# EAGLE design Ham-Dip-V2-002 (EAGLE 8.2.1)
VCC: 5v
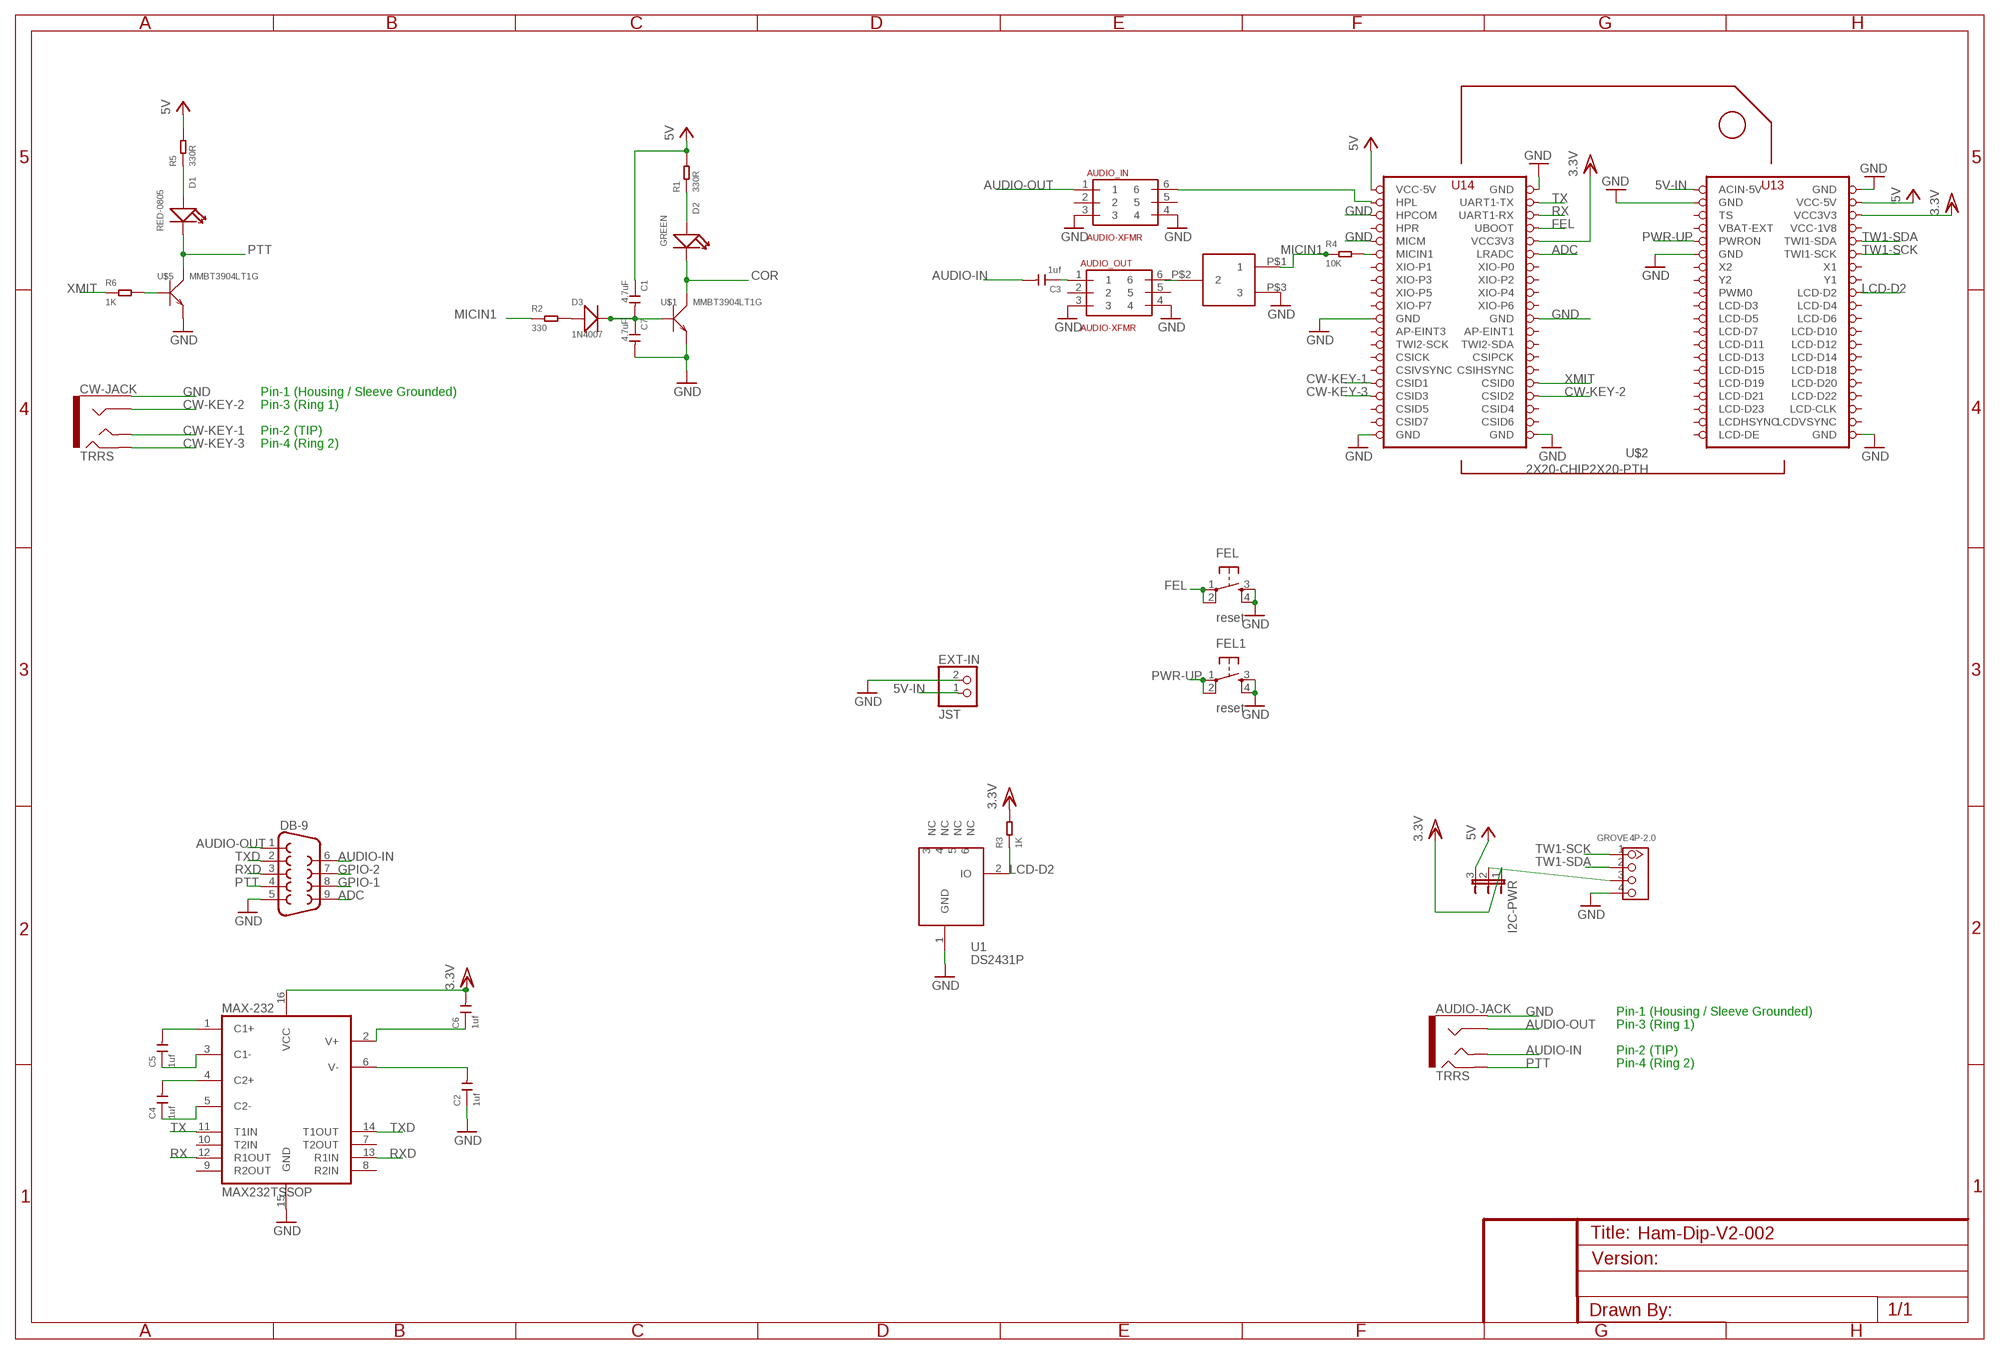
[diagram p0: schematic, sheet 1]

## Parts
AUDIO-JACK  TRRS  AUDIO-JACK3  [AUDIO-JACK-TRRS-SMD]
AUDIO_IN  AUDIO-XFMR  SM-LP-5001  [SM-LP-5001]
AUDIO_OUT  AUDIO-XFMR  SM-LP-5001  [SM-LP-5001]
C1  4.7uF  CERAMIC-1UF-25V-10%-X7R(0805)  [C0805]
C2  1uf  CERAMIC-1UF-25V-10%-X7R(0805)  [C0805]
C3  1uf  CERAMIC-1UF-25V-10%-X7R(0805)  [C0805]
C4  1uf  CERAMIC-1UF-25V-10%-X7R(0805)  [C0805]
C5  1uf  CERAMIC-1UF-25V-10%-X7R(0805)  [C0805]
C6  1uf  CERAMIC-1UF-25V-10%-X7R(0805)  [C0805]
C7  4.7uF  CERAMIC-1UF-25V-10%-X7R(0805)  [C0805]
CW-JACK  TRRS  AUDIO-JACK3  [AUDIO-JACK-TRRS-SMD]
D1  RED-0805  SMD-LED-CLEAR-RED(0805)  [LED-0805]
D2  GREEN  SMD-LED-CLEAR-RED(0805)  [LED-0805]
D3  1N4007  DIODE-GEN-PURPOSE-1KV-1A(DO-214AC)  [DO-214AC]
DB-9  DB9FEMALE  [DB9]
EXT-IN  JST  JST_2PIN-THM  [JST-PH-2-THM]
FEL  reset  TAC_SWITCHSMD  [TACTILE_SWITCH_SMD]
FEL1  reset  TAC_SWITCHSMD  [TACTILE_SWITCH_SMD]
GROVE  4P-2.0  GROVE-CONNECTOR-DIP(4P-2.0)  [HW4-2.0]
I2C-PWR  JP2E  [JP2]
MAX-232  MAX232TSSOP  [TSSOP16]
R1  330R  SMD-RES-220R-5%-1/8W(0805)  [R0805]
R2  330  SMD-RES-220R-5%-1/8W(0805)  [R0805]
R3  1K  SMD-RES-220R-5%-1/8W(0805)  [R0805]
R4  10K  SMD-RES-10K-1%-1/8W(0805)  [R0805]
R5  330R  SMD-RES-220R-5%-1/8W(0805)  [R0805]
R6  1K  SMD-RES-220R-5%-1/8W(0805)  [R0805]
U1  DS2431P  [TSOC6]
U$1  MMBT3904LT1G  SMD-TRANSISTORS-NPN-40V-200MA-MMBT3904LT1G(SOT-23)  [SOT-23]
U$2  2X20-CHIP2X20-PTH  2X20-CHIP2X20-PTH-CHIP_A  [2X20CHIP-TH]
U$3  TC33X  [TC33X]
U$5  MMBT3904LT1G  SMD-TRANSISTORS-NPN-40V-200MA-MMBT3904LT1G(SOT-23)  [SOT-23]

## Nets
5V-IN: EXT-IN.1 U$2.CHG-IN(ACIN-5V)
ADC: DB-9.9 U$2.LRADC
AUDIO-IN: AUDIO-JACK.TIP C3.2 DB-9.6
AUDIO-OUT: AUDIO-JACK.RING1 AUDIO_IN.1 DB-9.1
COR: D2.- U$1.3(C)
CW-KEY-1: CW-JACK.TIP U$2.CSID1
CW-KEY-2: CW-JACK.RING1 U$2.CSID2
CW-KEY-3: CW-JACK.RING2 U$2.CSID3
FEL: FEL.1 FEL.2 U$2.FEL(UBOOT)
GND: AUDIO-JACK.EARTH AUDIO_IN.3 AUDIO_IN.4 AUDIO_OUT.3 AUDIO_OUT.4 C2.1 C7.2 CW-JACK.EARTH DB-9.5 EXT-IN.2 FEL1.3 FEL1.4 FEL.3 FEL.4 GROVE.4 MAX-232.15(GND) U1.1(GND) U$1.2(E) U$2.GND@1(GND) U$2.GND@2(GND) U$2.GND@3(GND) U$2.GND@4(GND) U$2.GND@5(GND) U$2.GND@6(GND) U$2.GND@7(GND) U$2.GND@8(GND) U$2.GND@10(GND) U$2.HPCOM U$2.MICM U$3.P$3 U$5.2(E)
GPIO-1: DB-9.8
GPIO-2: DB-9.7
IN: AUDIO_OUT.1 C3.1
LCD-D2: R3.1 U1.2(IO) U$2.LCD-D2
MICIN1: R2.1 R4.2 U$2.MICIN1
N$1: D1.+ R5.1
N$3: AUDIO_IN.6 U$2.HPL
N$4: U$3.P$2
N$5: GROVE.3 I2C-PWR.2
N$6: C6.1 MAX-232.2(V+)
N$7: R4.1 U$3.P$1
N$8: R6.2 U$5.1(B)
N$9: D2.+ R1.1
N$10: C1.2 C7.1 D3.2(-) U$1.1(B)
N$11: C2.2 MAX-232.6(V-)
N$12: D3.1(+) R2.2
N$16: C5.2 MAX-232.1(C1+)
N$17: C4.2 MAX-232.4(C2+)
N$18: C5.1 MAX-232.3(C1-)
N$19: C4.1 MAX-232.5(C2-)
PTT: AUDIO-JACK.RING2 D1.- DB-9.4 U$5.3(C)
PWR-UP: FEL1.1 FEL1.2 U$2.PWRON
RX: MAX-232.12(R1OUT) U$2.UART1-RX
RXD: DB-9.3 MAX-232.13(R1IN)
TW1-SCK: GROVE.1 U$2.TWI1-SCK
TW1-SDA: GROVE.2 U$2.TWI1-SDA
TX: MAX-232.11(T1IN) U$2.UART1-TX
TXD: DB-9.2 MAX-232.14(T1OUT)
VCC: C1.1 I2C-PWR.3 R1.2 R5.2 U$2.VCC5V@0(VCC-5V) U$2.VCC5V@1(VCC-5V) ; supply symbol labelled 5V
VCC/2: C6.2 I2C-PWR.1 MAX-232.16(VCC) R3.2 U$2.VCC3V3 U$2.VCC3V3@1(VCC3V3) ; supply symbol labelled 3.3V
XMIT: R6.1 U$2.CSID0
Unconnected: AUDIO_IN.2 AUDIO_IN.5 AUDIO_OUT.2 AUDIO_OUT.5 AUDIO_OUT.6 MAX-232.7(T2OUT) MAX-232.8(R2IN) MAX-232.9(R2OUT) MAX-232.10(T2IN) U1.3(NC) U1.4(NC) U1.5(NC) U1.6(NC) U$2.AP-EINT1 U$2.AP-EINT3 U$2.BAT(VBAT-EXT) U$2.CSICK U$2.CSID4 U$2.CSID5 U$2.CSID6 U$2.CSID7 U$2.CSIHSYNC U$2.CSIPCK U$2.CSIVSYNC U$2.HPR U$2.LCD-CLK U$2.LCD-D3 U$2.LCD-D4 U$2.LCD-D5 U$2.LCD-D6 U$2.LCD-D7 U$2.LCD-D10 U$2.LCD-D11 U$2.LCD-D12 U$2.LCD-D13 U$2.LCD-D14 U$2.LCD-D15 U$2.LCD-D18 U$2.LCD-D19 U$2.LCD-D20 U$2.LCD-D21 U$2.LCD-D22 U$2.LCD-D23 U$2.LCD-DE U$2.LCD-HSYNC(LCDHSYNC) U$2.LCD-VSYNC(LCDVSYNC) U$2.PWM0 U$2.TS U$2.TWI2-SCK U$2.TWI2-SDA U$2.X1 U$2.X2 U$2.XIO-P0 U$2.XIO-P1 U$2.XIO-P2 U$2.XIO-P3 U$2.XIO-P4 U$2.XIO-P5 U$2.XIO-P6 U$2.XIO-P7 U$2.Y1 U$2.Y2

## Notes on the sheet
- Pin-1 (Housing / Sleeve Grounded)
- Pin-3 (Ring 1)
- Pin-2 (TIP)
- Pin-4 (Ring 2)
- Pin-1 (Housing / Sleeve Grounded)
- Pin-3 (Ring 1)
- Pin-2 (TIP)
- Pin-4 (Ring 2)

## Power pins joined to a net without a drawn wire
VCC-1V8: U$2.VCC1V8(VCC-1V8)

## Library data of the parts
AUDIO-JACK CW-JACK = SparkFun-Connectors:AUDIO-JACK3: Audio jack - 3.5mm TRRS variety - two rings.
AUDIO_IN AUDIO_OUT = HalfBakedCircuits:SM-LP-5001
C1 C7 = Seeed-Capacitor-2016:CERAMIC-1UF-25V-10%-X7R(0805): 302010179; MPN: CC0805KKX7R8BB105; VALUE: 1uf
C2-C6 = Seeed-Capacitor-2016:CERAMIC-1UF-25V-10%-X7R(0805): 302010179; MPN: CC0805KKX7R8BB105
D1 = Seeed-LED-2016:SMD-LED-CLEAR-RED(0805): 304090046; MPN: 17-215SURC/S530-A2/TR8
D2 = Seeed-LED-2016:SMD-LED-CLEAR-RED(0805): 304090046; MPN: 17-215SURC/S530-A2/TR8; VALUE: RED-0805
D3 = Seeed-Diode:DIODE-GEN-PURPOSE-1KV-1A(DO-214AC): 304010013; MPN: 1N4007
DB-9 = SparkFun-Connectors:DB9: DB9 Connector Standard DB9 (D-Sub 9) serial connector. Can be used for CAN bus as well as RS485 and RS232. Footprint production proven. Here is the female version connector we sell at SparkFun: 9 Pin Female Serial Connector - PCB Mount <https://www.sparkfun.com/products/429> (PRT-00429) This connector has been used on the following SparkFun products: SparkFun RS232 Shifter - SMD <https://www.sparkfun.com/products/449> (PRT-00449) SparkFun RS232 Shifter SMD (No DB9) <https://www.sparkfun.com/products/8780> (PRT-08780); PROD_ID: CONN-08194
EXT-IN = adafruit:JST_2PIN: JST 2-Pin Connectors of various flavors SMT-RA (S2B-PH-SM4) 4UConnector #17311 SMT (B2B-PH-SM4) THM-RA (S2B-PH) THM (B2B-PH)
FEL FEL1 = SparkFun-Electromechanical:TAC_SWITCH: Momentary Switch Button commonly used for reset or general input. Spark Fun Electronics SKU : COM-00097 SMT- SWCH-08247; PROD_ID: SWCH-08247
GROVE = Seeed-Connector -2016:GROVE-CONNECTOR-DIP(4P-2.0): 320110033
I2C-PWR = jumper:JP2E: JUMPER
MAX-232 = SparkFun-DigitalIC:MAX232: RS232 Transceiver Very common IC. This is generically called 'MAX232', but works with the 3V equivalent MAX3232 generic ICs. Field tested and mother approved. Spark Fun Electronics SKU : COM-00316 (DIP) and COM-00589 (SMD)
R1-R3 R5 R6 = Seeed-Resistor-2016:SMD-RES-220R-5%-1/8W(0805): 301010315; MPN: RC0805JR-07220RL; VALUE: 220R
R4 = Seeed-Resistor-2016:SMD-RES-10K-1%-1/8W(0805): 301010361; MPN: RC0805FR-0710KL
U1 = JKW_CHIP:DS2431: 1024-Bit EEPROM This chip provides a 4x256 Bit EEPROM, which can be programmed@5V. Write protection and OTP emulation are available, too. Author: Jan Kandziora <jjj@gmx.de>; DESCRIPTION: IC, 1024-Bit, 1-Wire EEPROM, TSOC6; FOOTPRINT: TSOC6; LINK: http://www.digikey.com/product-detail/en/DS2431P%2BT%26R/DS2431P%2BT%26RCT-ND/3647900; MFG: DIGIKEY; MFG_PN: DS2431P+T&RCT-ND; PART_TYPE: IC; PRICE: 0.98; VENDOR: MAXIM; VENDOR_PART_NUMBER: DS2431P+T&R
U$1 U$5 = Seeed-Transistor-2016:SMD-TRANSISTORS-NPN-40V-200MA-MMBT3904LT1G(SOT-23): 305010013; MPN: MMBT3904LT1G
U$2 = JKW_CHIP:2X20-CHIP: Chip header; DESCRIPTION: 2x20 .100" headers; FOOTPRINT: 2x20 .100" CHIP foot print; VENDOR: ASSMANN; VENDOR_PART_NUMBER: AWHW40-G-SMD-R (single)
U$3 = HalfBakedCircuits:TC33X

## Board
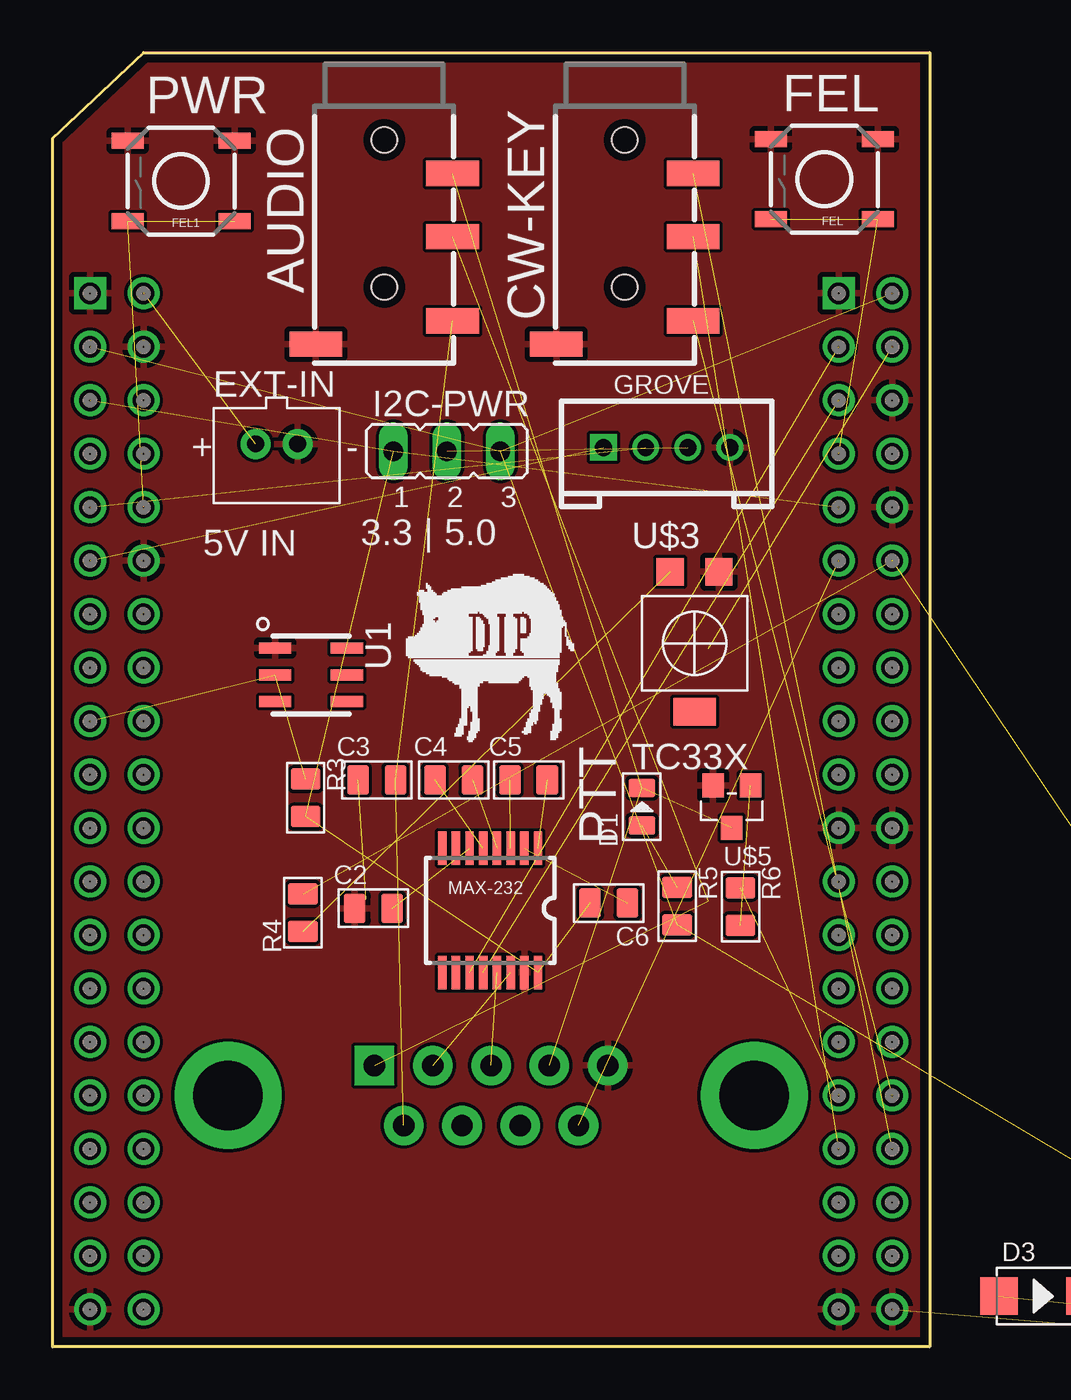
[diagram p1: board, top side]
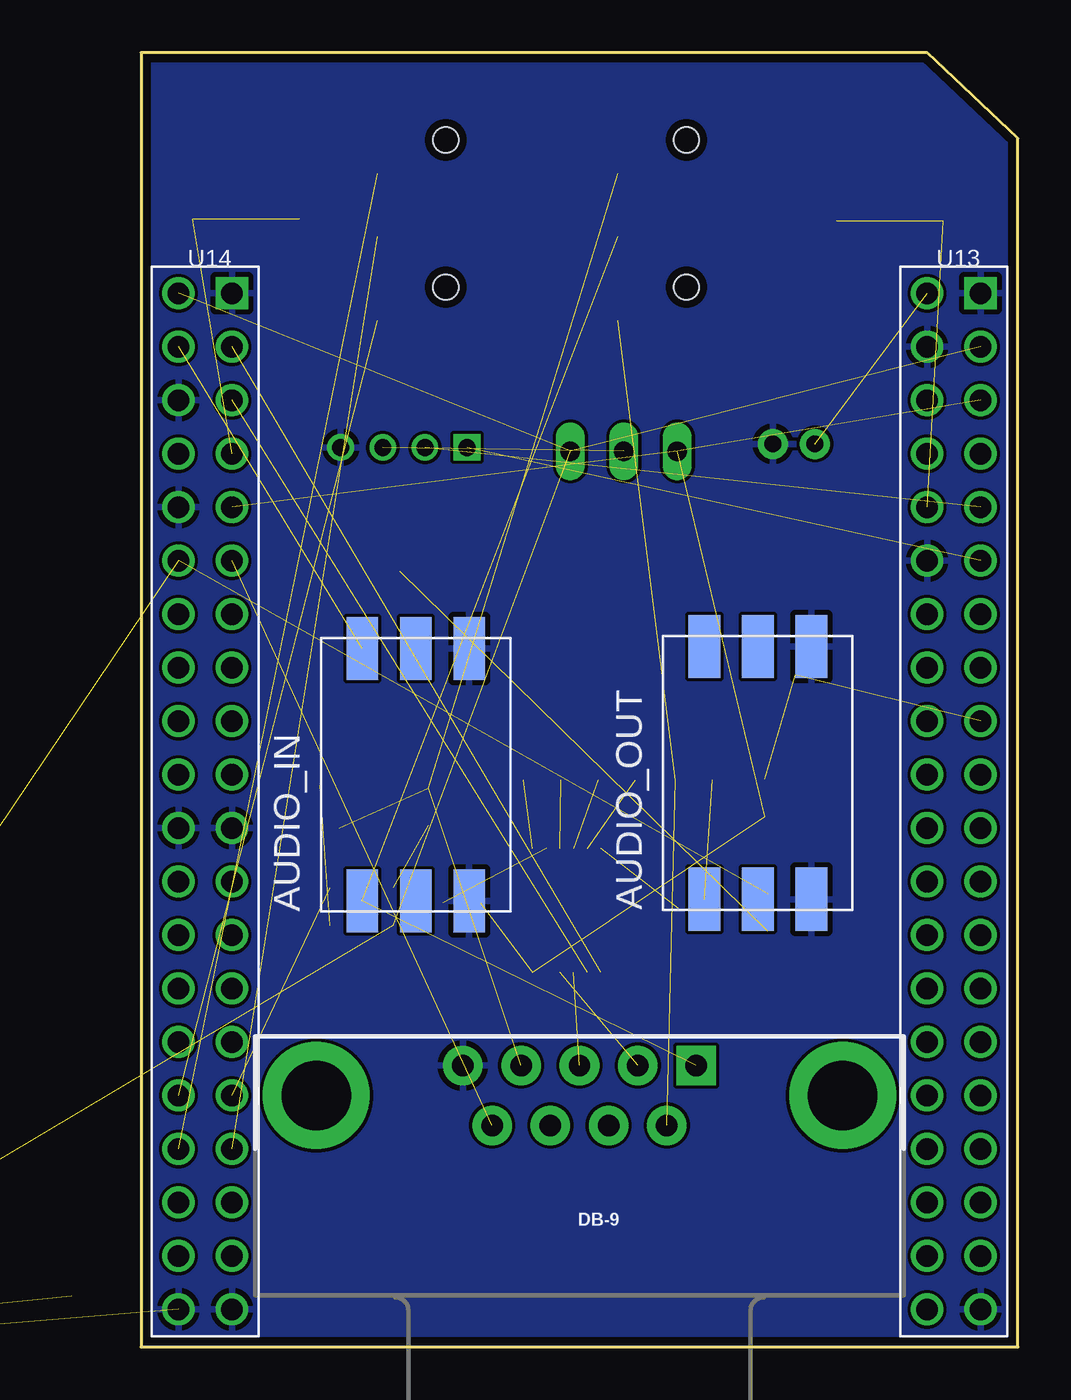
[diagram p2: board, bottom side, seen from below]

Size 41.66 x 61.47 mm. Coordinates in mm from the lower left corner, seen from the top.
Outline: 0,0 0,57.4 4.32,61.47 41.66,61.47 41.66,0 0,0
Copper layers (1*16): Top 0.0356mm / dielectric 1.5011mm / Bottom 0.0356mm
Design rules "oshpark-2layer": minimum track width 6mil, minimum drill 13mil, track to track 6mil, track to pad 6mil, pad to pad 6mil, via to via 6mil, smd to smd 6mil, copper to edge 15mil, drill to drill 6mil, minimum pad ring 7mil, minimum via ring 7mil, stop-mask expansion 2.5mil, vias tented up to drill 0mil, thermal gap 10mil

### Footprints (pad centres in the part's own frame; a part is rotated, then mirrored left to right if it is on the bottom)
AUDIO-JACK-TRRS-SMD = smd 1.2 x 2.5: EARTH 11.3,-3.25; RING1 6.2,3.25; RING2 3.2,3.25; TIP 10.2,3.25 | hole 1.2: 1.6,0; 8.6,0
SM-LP-5001 = smd 3 x 1.5: 1 -6,2.54; 2 -6,0; 3 -6,-2.54; 4 6,-2.54; 5 6,0; 6 6,2.54
C0805 = smd 1.397 x 1.016: 1 0,0.889; 2 0,-0.889
LED-0805 = smd 0.889 x 1.27: + -0.889,0; - 0.889,0
DO-214AC = smd 1.8 x 1.77: 1 -2.042,0; 2 2.042,0
DB9 = drill 1.016 pad 1.88 square: 1 -5.54,-1.42 | drill 1.016 pad 1.88: 2 -2.77,-1.42; 3 0,-1.42; 4 2.77,-1.42; 5 5.54,-1.42; 6 -4.15,1.42; 7 -1.38,1.42; 8 1.38,1.42; 9 4.15,1.42 | drill 3.302 pad 5.08: G1 -12.5,0; G2 12.5,0
JST-PH-2-THM = drill 0.8 pad 1.422: 1 1,0; 2 -1,0
TACTILE_SWITCH_SMD = smd 1.524 x 0.762: 1 -2.54,1.905; 2 2.54,1.905; 3 -2.54,-1.905; 4 2.54,-1.905
HW4-2.0 = drill 0.8 pad 1.27 square: 1 -3,0 | drill 0.8 pad 1.27: 2 -1,0; 3 1,0; 4 3,0
JP2 = drill 0.914 long: 1 -2.54,0; 2 0,0; 3 2.54,0
TSSOP16 = smd 0.4 x 1.6: 1 -2.225,-2.85; 2 -1.575,-2.85; 3 -0.925,-2.85; 4 -0.275,-2.85; 5 0.375,-2.85; 6 1.025,-2.85; 7 1.675,-2.85; 8 2.325,-2.85; 9 2.325,3.05; 10 1.675,3.05; 11 1.025,3.05; 12 0.375,3.05; 13 -0.275,3.05; 14 -0.925,3.05; 15 -1.575,3.05; 16 -2.225,3.05
R0805 = smd 1.397 x 1.016: 1 0,0.889; 2 0,-0.889
TSOC6 = smd 0.53 x 1.53: 1 -1.27,-1.7; 2 0,-1.7; 3 1.27,-1.7; 4 1.27,1.7; 5 0,1.7; 6 -1.27,1.7
SOT-23 = smd 1.016 x 1.143: 1 -0.889,-1.016; 2 0.889,-1.016; 3 0,1.016
2X20CHIP-TH = drill 1.016: AP-EINT1 36.83,21.59; AP-EINT3 39.37,21.59; BAT 3.81,41.91; CHG-IN 3.81,49.53; CSICK 39.37,16.51; CSID0 36.83,11.43; CSID1 39.37,11.43; CSID2 36.83,8.89; CSID3 39.37,8.89; CSID4 36.83,6.35; CSID5 39.37,6.35; CSID6 36.83,3.81; CSID7 39.37,3.81; CSIHSYNC 36.83,13.97; CSIPCK 36.83,16.51; CSIVSYNC 39.37,13.97; FEL 36.83,41.91; GND@1 3.81,36.83; GND@2 1.27,1.27; GND@4 39.37,24.13; GND@5 39.37,1.27; GND@6 36.83,1.27; GND@7 36.83,24.13; GND@10 3.81,46.99; HPCOM 39.37,44.45; HPL 39.37,46.99; HPR 39.37,41.91; LCD-CLK 1.27,6.35; LCD-D2 1.27,29.21; LCD-D3 3.81,26.67; LCD-D4 1.27,26.67; LCD-D5 3.81,24.13; LCD-D6 1.27,24.13; LCD-D7 3.81,21.59; LCD-D10 1.27,21.59; LCD-D11 3.81,19.05; LCD-D12 1.27,19.05; LCD-D13 3.81,16.51; LCD-D14 1.27,16.51; LCD-D15 3.81,13.97; LCD-D18 1.27,13.97; LCD-D19 3.81,11.43; LCD-D20 1.27,11.43; LCD-D21 3.81,8.89; LCD-D22 1.27,8.89; LCD-D23 3.81,6.35; LCD-DE 3.81,1.27; LCD-HSYNC 3.81,3.81; LCD-VSYNC 1.27,3.81; LRADC 36.83,36.83; MICIN1 39.37,36.83; MICM 39.37,39.37; PWM0 3.81,29.21; PWRON 3.81,39.37; TS 3.81,44.45; TWI1-SCK 1.27,36.83; TWI1-SDA 1.27,39.37; TWI2-SCK 39.37,19.05; TWI2-SDA 36.83,19.05; UART1-RX 36.83,44.45; UART1-TX 36.83,46.99; VCC1V8 1.27,41.91; VCC3V3 1.27,44.45; VCC3V3@1 36.83,39.37; VCC5V@0 1.27,46.99; VCC5V@1 39.37,49.53; X1 1.27,34.29; X2 3.81,34.29; XIO-P0 36.83,34.29; XIO-P1 39.37,34.29; XIO-P2 36.83,31.75; XIO-P3 39.37,31.75; XIO-P4 36.83,29.21; XIO-P5 39.37,29.21; XIO-P6 36.83,26.67; XIO-P7 39.37,26.67; Y1 1.27,31.75; Y2 3.81,31.75 | drill 1.016 square: GND@3 1.27,49.53; GND@8 36.83,49.53
TC33X = smd 1.3 x 1.3: P$1 -1.155,3.4; P$3 1.155,3.4 | smd 2 x 1.3: P$2 0,-3.25

### Placement (x,y rotation side)
AUDIO-JACK  15.75,58.93 270 top
AUDIO_IN  28.61,27.17 90 bottom
AUDIO_OUT  12.36,27.26 90 bottom
C1  59.5,1.41 0 top  (outside the outline)
C2  15.24,20.83 90 top
C3  15.39,26.92 90 top
C4  19.05,26.92 90 top
C5  22.61,26.92 90 top
C6  26.42,21.08 270 top
C7  55,1.41 0 top  (outside the outline)
CW-JACK  27.18,58.93 270 top
D1  27.99,25.65 90 top
D2  56,5.91 0 top  (outside the outline)
D3  47,2.41 0 top  (outside the outline)
DB-9  20.83,11.94 180 bottom
EXT-IN  10.64,42.89 180 top
FEL  36.66,55.46 180 top
FEL1  6.1,55.37 180 top
GROVE  29.17,42.72 0 top
I2C-PWR  18.73,42.53 0 top
MAX-232  20.83,20.83 180 top
R1  66.5,7.91 0 top  (outside the outline)
R2  63.5,1.41 0 top  (outside the outline)
R3  12.02,26.07 0 top
R4  11.89,20.62 180 top
R5  29.67,20.93 0 top
R6  32.67,20.91 0 top
U1  12.27,31.91 270 top
U$1  61.5,6.91 0 top  (outside the outline)
U$2  0.51,0.51 0 top
U$3  30.5,33.41 0 top
U$5  32.26,25.65 180 top

### Tracks (layer width: path | path; a pad name or v marks a point on that pad's centre or on a via)
5V-IN  (1 unrouted)
ADC  (1 unrouted)
AUDIO-IN  (2 unrouted)
AUDIO-OUT  (2 unrouted)
COR  (1 unrouted)
CW-KEY-1  (1 unrouted)
CW-KEY-2  (1 unrouted)
CW-KEY-3  (1 unrouted)
FEL  (2 unrouted)
GND  (2 unrouted)
  pour Bottom: -2.03,61.47 42.59,61.47 42.42,-0.76 -2.03,-0.76
  pour Top: -4.57,61.47 41.15,61.47 41.15,-2.03 -4.57,-2.03
IN  (1 unrouted)
LCD-D2  (2 unrouted)
MICIN1  (2 unrouted)
N$1  (1 unrouted)
N$3  (1 unrouted)
N$5  (1 unrouted)
N$6  (1 unrouted)
N$7  (1 unrouted)
N$8  (1 unrouted)
N$9  (1 unrouted)
N$10  (3 unrouted)
N$11  (1 unrouted)
N$12  (1 unrouted)
N$16  (1 unrouted)
N$17  (1 unrouted)
N$18  (1 unrouted)
N$19  (1 unrouted)
PTT  (3 unrouted)
PWR-UP  (2 unrouted)
RX  (1 unrouted)
RXD  (1 unrouted)
TW1-SCK  (1 unrouted)
TW1-SDA  (1 unrouted)
TX  (1 unrouted)
TXD  (1 unrouted)
VCC  (5 unrouted)
VCC/2  (5 unrouted)
XMIT  (1 unrouted)

### Text on the board
tPlace: PWR | FEL | AUDIO | CW-KEY | 5V IN | 3.3 | 5.0 | PTT
_bsilk: HAM-DIP | REV: B | By: N4LDR / WD4VA / 7/15/2017 | 1 - AUDIO OUT 6 - AUDIO IN / 2 - TX 7 - GPIO 2 / 3 - RX 8 - GPIO 1 / 4 - PTT 9 - ANALOG IN / 5 - GND